# EAGLE design Part_Ninja_V1d (EAGLE 5.07)
PROJECT: Part Ninja v1d
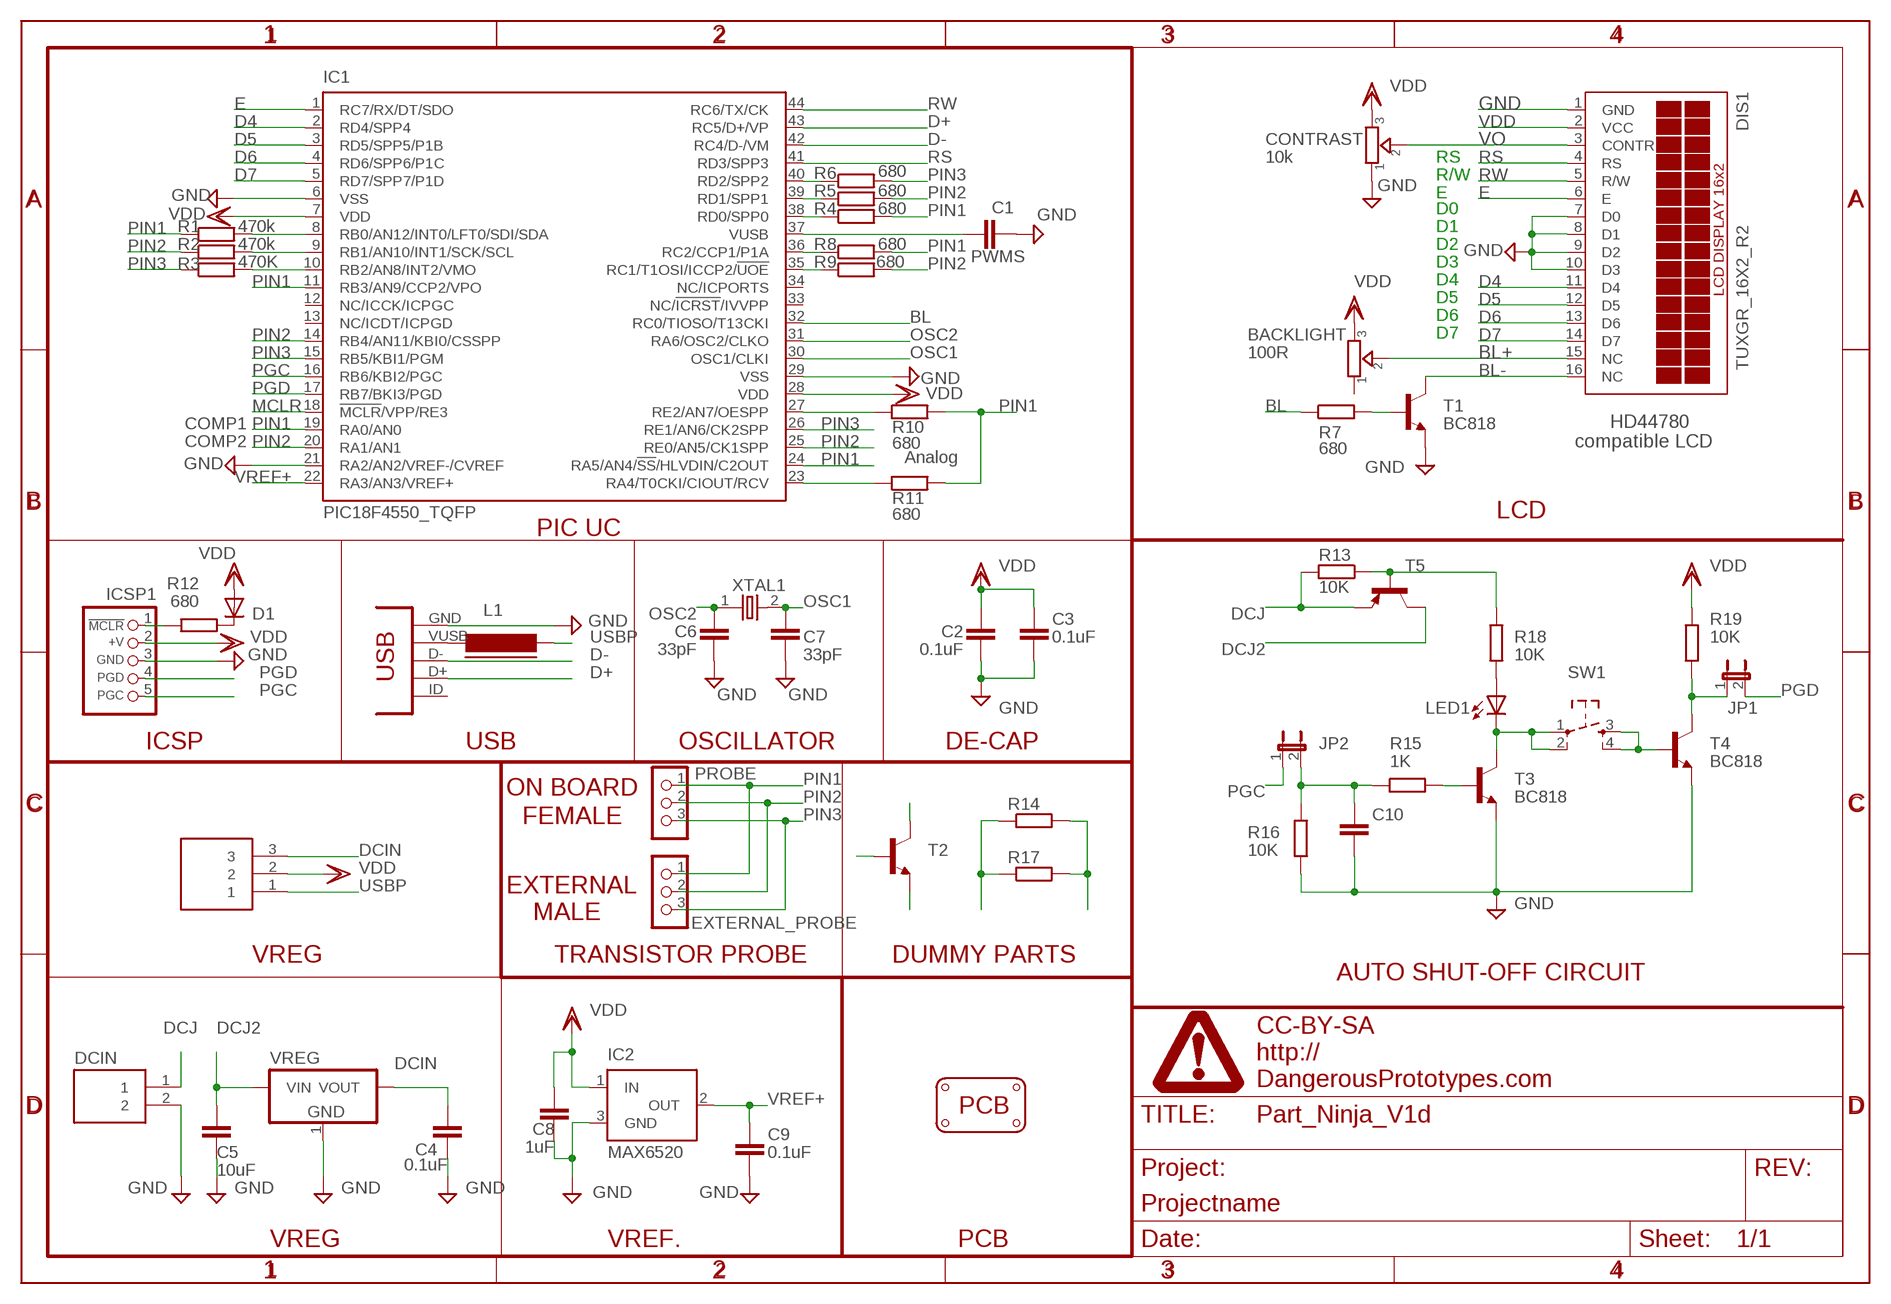
[diagram p0: schematic, sheet 1]

## Parts
BACKLIGHT  100R  TRIMMER-3306F  [TRIMMER_3306F]
C1  CAPC603  [C603]
C2  0.1uF  CAPC603  [C603]
C3  0.1uF  CAPC603  [C603]
C4  0.1uF  CAPC603  [C603]
C5  10uF  CAPC603  [C603]
C6  33pF  CAPC603  [C603]
C7  33pF  CAPC603  [C603]
C8  1uF  CAPC603  [C603]
C9  0.1uF  CAPC603  [C603]
C10  CAPC603  [C603]
CONTRAST  10k  TRIMMER-3306F  [TRIMMER_3306F]
D1  D-SOD123  [SOD123]
DCIN  HEADER1X2PTH  [M1X2]
DIS1  TUXGR_16X2_R2  [TUXGR_16X2_R2]
EXTERNAL_PROBE  CON_HEADER_1X03-2  [M1X3_2]
IC1  PIC18F4550_TQFP  [TQFP44]
IC2  MAX6520  [SOT23]
ICSP1  HEADER_PRG_PIC_ICSPB  [HEADER_PRG_1X05_ICSP_B]
JP1  JP1E  [JP1]
JP2  JP1E  [JP1]
L1  FERRITE_BEAD603  [FB603]
LED1  LED805  [LED-805]
PCB2  PCB_DP_RECTANGLE-6.2X10  [DP10062_V1]
PROBE  CON_HEADER_1X03-2  [M1X3_2]
PWR  HEADER1X3PTH  [M1X3]
R1  470k  RESISTORR603  [R603]
R2  470k  RESISTORR603  [R603]
R3  470K  RESISTORR603  [R603]
R4  680  RESISTORR603  [R603]
R5  680  RESISTORR603  [R603]
R6  680  RESISTORR603  [R603]
R7  680  RESISTORR603  [R603]
R8  680  RESISTORR603  [R603]
R9  680  RESISTORR603  [R603]
R10  680  RESISTORR603  [R603]
R11  680  RESISTORR603  [R603]
R12  680  RESISTORR603  [R603]
R13  10K  RESISTORR603  [R603]
R14  RESISTORR1206  [R1206]
R15  1K  RESISTORR603  [R603]
R16  10K  RESISTORR603  [R603]
R17  RESISTORR603  [R603]
R18  10K  RESISTORR603  [R603]
R19  10K  RESISTORR603  [R603]
SW1  SW_TACT  [SW_TACT_SMALL]
T1  BC818  NPNSOT23BEC  [SOT23-BEC]
T2  BC818  NPNSOT23BEC  [SOT23-BEC]
T3  BC818  NPNSOT23BEC  [SOT23-BEC]
T4  BC818  NPNSOT23BEC  [SOT23-BEC]
T5  BJT-PNPSOT23BEC  [SOT23-BEC]
U$1  DINA4_L  [DP_LOGO]
USB1  CON-USB-MINI-BUSB1  [CONN_USB_MINI-B]
VREG  LD1117-3.3SOT223  [SOT223]
XTAL1  OSC-XTAL  [HC-49U]

## Nets
BL: IC1.32(RC0/TIOSO/T13CKI) R7.1
BL+: BACKLIGHT.2 DIS1.15(NC)
BL-: DIS1.16(NC) T1.C
D4: DIS1.11(D4) IC1.2(RD4/SPP4)
D5: DIS1.12(D5) IC1.3(RD5/SPP5/P1B)
D6: DIS1.13(D6) IC1.4(RD6/SPP6/P1C)
D7: DIS1.14(D7) IC1.5(RD7/SPP7/P1D)
D+: IC1.43(RC5/D+/VP) USB1.D+
D-: IC1.42(RC4/D-/VM) USB1.D-
DCIN: C4.2 PWR.3 VREG.2(VOUT)
DCJ: DCIN.1 R13.2 T5.E
DCJ2: C5.2 T5.C VREG.3(VIN)
E: DIS1.6(E) IC1.1(RC7/RX/DT/SDO)
GND: C1.2 C2.1 C3.1 C4.1 C5.1 C6.1 C7.1 C8.1 C9.1 C10.1 CONTRAST.1 DCIN.2 DIS1.1(GND) DIS1.7(D0) DIS1.8(D1) DIS1.9(D2) DIS1.10(D3) IC1.6(VSS) IC1.21(RA2/AN2/VREF-/CVREF) IC1.29(VSS) IC2.3(GND) ICSP1.3(GND) R16.1 T1.E T3.E T4.E USB1.GND VREG.1(GND)
MCLR: IC1.18(!MCLR!/VPP/RE3) ICSP1.1(/MCLR) R12.1
N$1: R7.2 T1.B
N$2: IC1.8(RB0/AN12/INT0/LFT0/SDI/SDA) R1.2
N$3: IC1.9(RB1/AN10/INT1/SCK/SCL) R2.2
N$4: IC1.10(RB2/AN8/INT2/VMO) R3.2
N$5: IC1.38(RD0/SPP0) R4.1
N$6: IC1.39(RD1/SPP1) R5.1
N$7: IC1.40(RD2/SPP2) R6.1
N$8: IC1.27(RE2/AN7/OESPP) R10.1
N$9: LED1.A R18.1
N$10: C1.1 IC1.37(VUSB)
N$11: IC1.23(RA4/T0CKI/CIOUT/RCV) R11.1
N$12: IC1.36(RC2/CCP1/P1A) R8.1
N$13: IC1.35(RC1/T1OSI/ICCP2/!UOE) R9.1
N$14: D1.1(C) R12.2
N$16: SW1.3 SW1.4 T4.B
N$17: R13.1 R18.2 T5.B
N$18: LED1.C SW1.1 SW1.2 T3.C
N$19: R15.2 T3.B
N$21: JP1.1 R19.1 T4.C
N$22: C10.2 JP2.2 R15.1 R16.2
N$23: L1.1 USB1.VUSB
OSC1: C7.2 IC1.30(OSC1/CLKI) XTAL1.2
OSC2: C6.2 IC1.31(RA6/OSC2/CLKO) XTAL1.1
PGC: IC1.16(RB6/KBI2/PGC) ICSP1.5(PGC) JP2.1
PGD: IC1.17(RB7/BKI3/PGD) ICSP1.4(PGD) JP1.2
PIN1: EXTERNAL_PROBE.1 IC1.11(RB3/AN9/CCP2/VPO) IC1.19(RA0/AN0) IC1.24(RA5/AN4/!SS!/HLVDIN/C2OUT) PROBE.1 R1.1 R4.2 R8.2 R10.2 R11.2 R14.1 R17.1 T2.C
PIN2: EXTERNAL_PROBE.2 IC1.14(RB4/AN11/KBI0/CSSPP) IC1.20(RA1/AN1) IC1.25(RE0/AN5/CK1SPP) PROBE.2 R2.1 R5.2 R9.2 R14.2 R17.2 T2.B
PIN3: EXTERNAL_PROBE.3 IC1.15(RB5/KBI1/PGM) IC1.26(RE1/AN6/CK2SPP) PROBE.3 R3.1 R6.2 T2.E
RS: DIS1.4(RS) IC1.41(RD3/SPP3)
RW: DIS1.5(R/W) IC1.44(RC6/TX/CK)
USBP: L1.2 PWR.1
VDD: BACKLIGHT.3 C2.2 C3.2 C8.2 CONTRAST.3 D1.2(A) DIS1.2(VCC) IC1.7(VDD) IC1.28(VDD) IC2.1(IN) ICSP1.2(+V) PWR.2 R19.2
VO: CONTRAST.2 DIS1.3(CONTR)
VREF+: C9.2 IC1.22(RA3/AN3/VREF+) IC2.2(OUT)
Unconnected: BACKLIGHT.1 IC1.12(NC/ICCK/ICPGC) IC1.13(NC/ICDT/ICPGD) IC1.33(NC/!ICRST!/IVVPP) IC1.34(NC/ICPORTS) USB1.BODY@1(BODY) USB1.BODY@2(BODY) USB1.BODY@3(BODY) USB1.BODY@4(BODY) USB1.ID(USBID)

## Notes on the sheet
- RS
- R/W
- E
- D0
- D1
- PWMS | D2
- D3
- D4
- D5
- D6
- D7
- COMP1 | HD44780
- COMP2 | compatible LCD
- Analog
- LCD
- PIC UC
- ICSP | USB | OSCILLATOR | DE-CAP
- ON BOARD
- FEMALE
- EXTERNAL
- MALE
- VREG | TRANSISTOR PROBE | DUMMY PARTS
- AUTO SHUT-OFF CIRCUIT
- VREG | VREF. | PCB

## Library data of the parts
BACKLIGHT CONTRAST = dp_devices:TRIMMER: Trimmer resistor
C1-C10 = dp_devices:CAP
D1 = semicon-smd-ipc:D-: DIODE unfilled
DCIN = dp_devices:HEADER1X2
DIS1 = display-lcd:TUXGR_16X2_R2: Tuxgraphics LCD display 16x2 characters reflective, without background light Source: tuxgr_12x2_r2.pdf
EXTERNAL_PROBE PROBE = centered_logo:CON_HEADER_1X03
IC1 = microchip:PIC18F4*_TQFP: USB Microcontrollers with nanoWatt Technology High-Performance, Enhanced Flash, 28/40/44-Pin, Source: http://ww1.microchip.com/downloads/en/devicedoc/39632c.pdf; MF: MICROCHIP; MPN: PIC18F4550-I/PT; OC_FARNELL: 9321365; OC_NEWARK: 08J9633
IC2 = maxim:MAX6520: 1.2V Voltage Reference 50ppm/°C, SOT23, 3-Terminal Source: http://datasheets.maxim-ic.com/en/ds/MAX6520.pdf; MF: MAXIM; MPN: MAX6520EUR-T; OC_FARNELL: unknown; OC_NEWARK: 02J4586
ICSP1 = dp_devices:HEADER_PRG_PIC_ICSP: 5-pin PIC In Circuit Serial Programming header
JP1 JP2 = jumper:JP1E: JUMPER
L1 = dp_devices:FERRITE_BEAD
LED1 = DP2:LED
PCB2 = dp_devices:PCB_DP_RECTANGLE: Dangerous Prototypes Standard Rectangular PCB sizes
PWR = dp_devices:HEADER1X3
R1-R13 R15 R16 R18 R19 = dp_devices:RESISTOR
R14 R17 = fifo:RESISTOR
SW1 = dp_devices:SW_TACT
T1-T4 = dp_devices:NPN: Most commonly used is SOT23-BEC
T5 = DP2:BJT-PNP: Most commonly used is SOT23-BEC
U$1 = DP2:DINA4_L: A4 DP frame Standard Dangerous Prototypes schematic frame. Automagically adds the DP logo and standard texts to the PCB Use the atrribute in the schematic editor to change the fields.; FF1: fulfillment by; FF2: Seeed Studio; FF3: www.seeedstudio.com; LICENSE: CC-BY-SA; PROJECT: Projectname; URL1: http://; URL2: DangerousPrototypes.com
USB1 = dp_devices:CON-USB-MINI-B: USB connector
VREG = dp_devices:LD1117-3.3
XTAL1 = dp_devices:OSC-XTAL

## Board
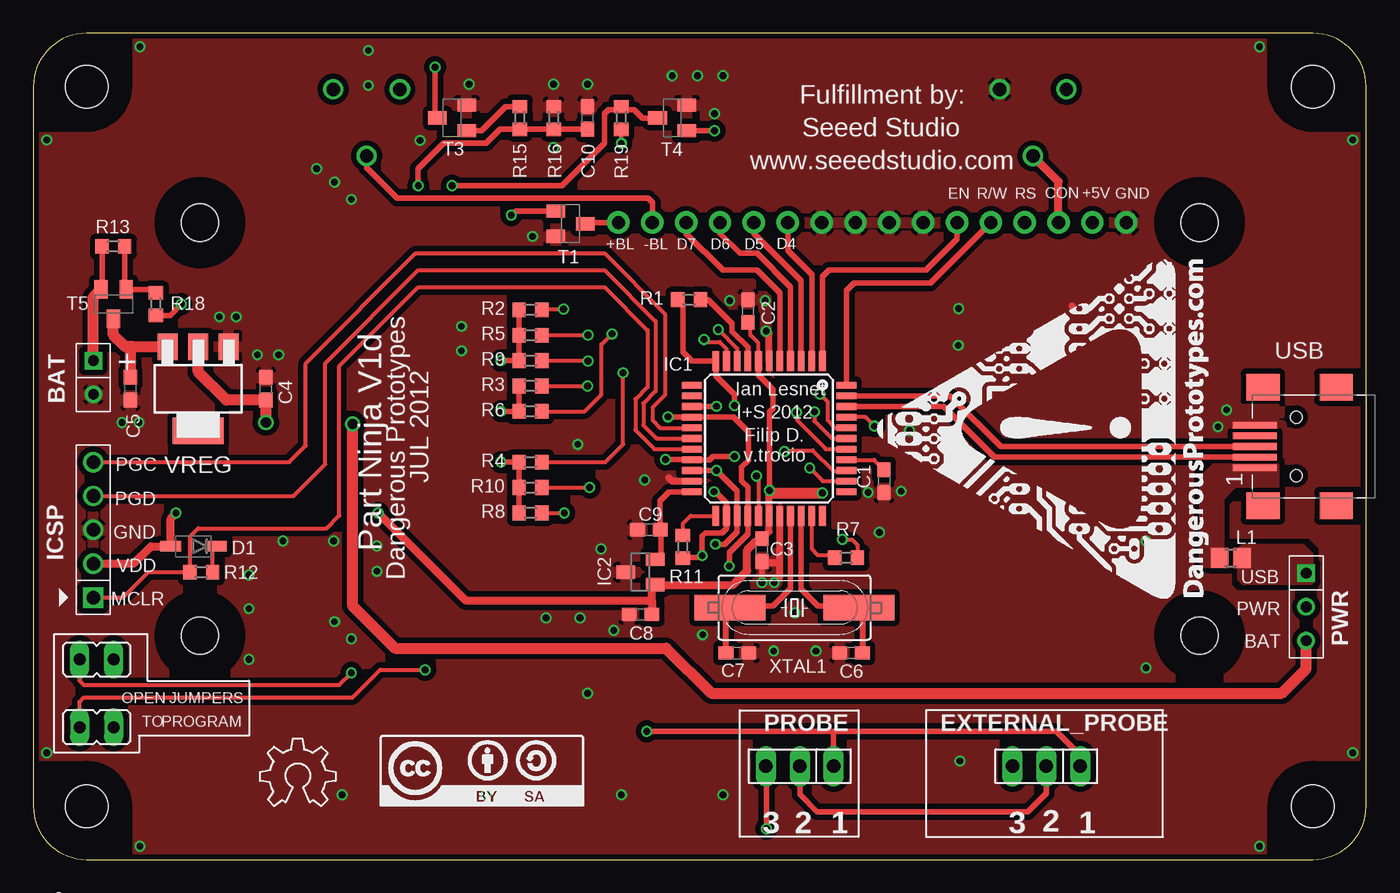
[diagram p1: board, top side]
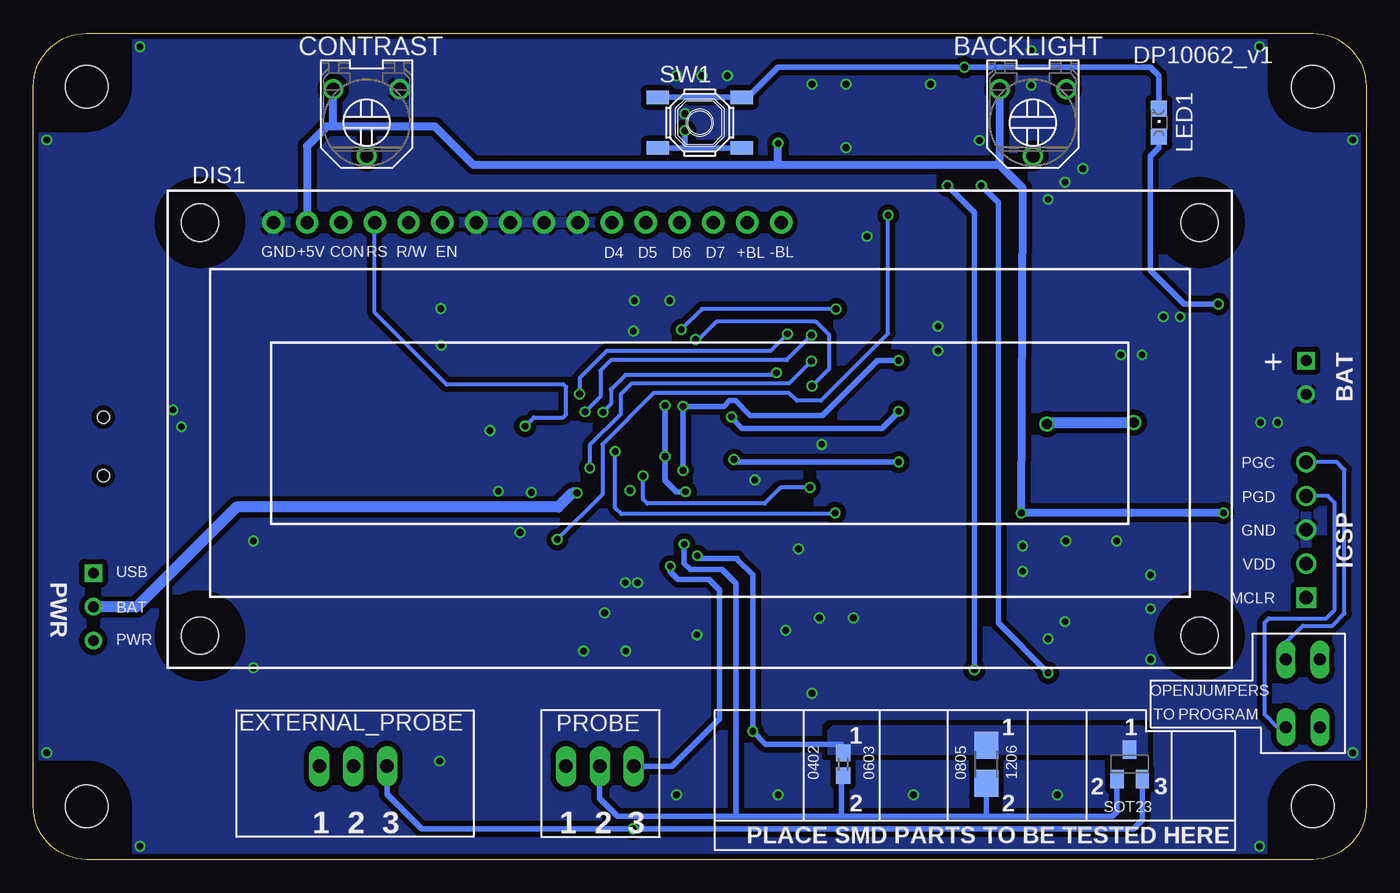
[diagram p2: board, bottom side, seen from below]

Size 100 x 62 mm. Coordinates in mm from the lower left corner, seen from the top.
Copper layers (1*16): Top 0.035mm / dielectric 1.5mm / Bottom 0.035mm
Design rules "Fusion_eagle_rule_v1.1": minimum track width 6mil, minimum drill 12mil, track to track 6mil, track to pad 6mil, pad to pad 6mil, via to via 6mil, smd to smd 0mil, copper to edge 10mil, drill to drill 10mil, minimum pad ring 10mil, minimum via ring 6mil, stop-mask expansion 2mil, vias tented up to drill 100mil, thermal gap 10mil
tRestrict: area 84.5,13.8 to 90.5,19.8; area 84.5,44.8 to 90.5,50.8; area 9.5,13.8 to 15.5,19.8; area 9.5,44.8 to 15.5,50.8
bRestrict: area 84.5,13.8 to 90.5,19.8; area 84.5,44.8 to 90.5,50.8; area 9.5,13.8 to 15.5,19.8; area 9.5,44.8 to 15.5,50.8

### Footprints (pad centres in the part's own frame; a part is rotated, then mirrored left to right if it is on the bottom)
TRIMMER_3306F = drill 1 round: 1 -2.5,-2.5; 2 0,2.5; 3 2.5,-2.5
C603 = smd 1.1 x 1: 1 -0.85,0; 2 0.85,0
SOD123 = smd 1.6 x 0.8: 1 -1.7,0; 2 1.7,0
M1X2 = drill 0.8 square: 1 -1.27,0 | drill 0.8 round: 2 1.27,0
TUXGR_16X2_R2 = drill 1 pad 1.676 round: 1 -32,15.5; 2 -29.46,15.5; 3 -26.92,15.5; 4 -24.38,15.5; 5 -21.84,15.5; 6 -19.3,15.5; 7 -16.76,15.5; 8 -14.22,15.5; 9 -11.68,15.5; 10 -9.14,15.5; 11 -6.6,15.5; 12 -4.06,15.5; 13 -1.52,15.5; 14 1.02,15.5; 15 3.56,15.5; 16 6.1,15.5 | hole 2.8: -37.5,-15.5; 37.5,-15.5; -37.5,15.5; 37.5,15.5
M1X3_2 = drill 1.016 long: 1 -2.54,0; 2 0,0; 3 2.54,0
TQFP44 = smd 1.5 x 0.5: 1 -5.8,4; 2 -5.8,3.2; 3 -5.8,2.4; 4 -5.8,1.6; 5 -5.8,0.8; 6 -5.8,0; 7 -5.8,-0.8; 8 -5.8,-1.6; 9 -5.8,-2.4; 10 -5.8,-3.2; 11 -5.8,-4; 23 5.8,-4; 24 5.8,-3.2; 25 5.8,-2.4; 26 5.8,-1.6; 27 5.8,-0.8; 28 5.8,0; 29 5.8,0.8; 30 5.8,1.6; 31 5.8,2.4; 32 5.8,3.2; 33 5.8,4 | smd 0.5 x 1.5: 12 -4,-5.8; 13 -3.2,-5.8; 14 -2.4,-5.8; 15 -1.6,-5.8; 16 -0.8,-5.8; 17 0,-5.8; 18 0.8,-5.8; 19 1.6,-5.8; 20 2.4,-5.8; 21 3.2,-5.8; 22 4,-5.8; 34 4,5.8; 35 3.2,5.8; 36 2.4,5.8; 37 1.6,5.8; 38 0.8,5.8; 39 0,5.8; 40 -0.8,5.8; 41 -1.6,5.8; 42 -2.4,5.8; 43 -3.2,5.8; 44 -4,5.8
SOT23 = smd 1 x 1.4: 1 -0.95,-1.1; 2 0.95,-1.1; 3 0,1.1
HEADER_PRG_1X05_ICSP_B = drill 1.016 square: 1 -5.08,0 | drill 1.016 round: 2 -2.54,0; 3 0,0; 4 2.54,0; 5 5.08,0
JP1 = drill 0.914 long: 1 0,-1.27; 2 0,1.27
FB603 = smd 1.3 x 1.5: 1 -0.85,0; 2 0.85,0
LED-805 = smd 1.2 x 1.2: A 0,-1.05; C 0,1.05
DP10062_V1 = hole 3.2: 4,4; 96,4; 96,58; 4,58
M1X3 = drill 0.8 square: 1 0,0 | drill 0.8 round: 2 2.54,0; 3 5.08,0
R603 = smd 1 x 1.1: 1 -0.85,0; 2 0.85,0
R1206 = smd 2.032 x 1.803: 1 -1.422,0; 2 1.422,0
R603' = smd 1.27 x 1.1: 1 -0.85,0; 2 0.85,0
SW_TACT_SMALL = smd 1.7 x 1: 1 -3.15,1.9; 2 3.15,1.9; 3 -3.15,-1.9; 4 3.15,-1.9
SOT23-BEC@1 = smd 1 x 1.4: B -0.95,-1.1; C 0,1.1; E 0.95,-1.1
SOT23-BEC = smd 1 x 1.4: B -0.95,-1.1; C 0,1.1; E 0.95,-1.1
CONN_USB_MINI-B = smd 2 x 2.5: BODY@1 -4.45,2.5; BODY@2 4.45,2.5; BODY@3 4.45,-3; BODY@4 -4.45,-3 | smd 0.5 x 3.3: D+ 0,3.1; D- -0.8,3.1; GND 1.6,3.1; ID 0.8,3.1; VUSB -1.6,3.1 | hole 0.9: -2.2,0; 2.2,0
SOT223 = smd 1.5 x 2: 1 -2.3,-3.15; 2 0,-3.15; 3 2.3,-3.15 | smd 3.8 x 2: 4 0,3.15
HC-49U = smd 5.334 x 1.93: 1 -4.826,0; 2 4.826,0

### Placement (x,y rotation side)
BACKLIGHT  25,55.3 180 bottom
C1  63.82,28.4 270 top
C2  53.61,41.16 270 top
C3  54.66,23.22 90 top
C4  17.45,35.33 270 top
C5  7.29,35.33 90 top
C6  61.36,15.5 0 top
C7  52.82,15.5 180 top
C8  45.55,18.39 0 top
C9  46.19,24.74 0 top
C10  41.58,55.65 270 top
CONTRAST  75,55.3 180 bottom
D1  12.01,23.5 180 top
DCIN  4.5,36.17 270 top
DIS1  50,32.3 0 bottom
EXTERNAL_PROBE  76,7 180 top
IC1  55.2,31.6 270 top
IC2  45.55,21.57 90 top
ICSP1  4.5,24.74 90 top
JP1  4.75,9.93 270 top
JP2  4.75,15.01 90 top
L1  89.84,22.63 0 top
LED1  15.55,55.3 0 bottom
PCB2  100,62 180 top
PROBE  57.5,7 180 top
PWR  95.5,21.5 270 top
R1  49.2,42.01 0 top
R2  37.3,41.25 0 top
R3  37.3,35.54 0 top
R4  37.3,29.82 180 top
R5  37.3,39.35 180 top
R6  37.3,33.63 180 top
R7  60.98,22.65 0 top
R8  37.3,26.01 180 top
R9  37.3,37.44 180 top
R10  37.3,27.92 180 top
R11  48.73,23.47 270 top
R12  12.61,21.57 0 top
R13  6,46 180 top
R14  28.5,7.15 270 bottom
R15  36.5,55.65 90 top
R16  39.04,55.65 270 top
R17  [R603']  39.25,7.15 270 bottom
R18  9.2,41.68 90 top
R19  44.12,55.65 270 top
SW1  50,55.3 0 bottom
T1  BC818  [SOT23-BEC@1]  40.31,47.71 270 top
T2  17.75,7.15 0 bottom
T3  31.42,55.65 90 top
T4  47.93,55.65 90 top
T5  6.02,41.68 180 top
U$1  1.91,-5.08 0 top  (outside the outline)
U$2  [DP_LOGO_ART_1X1]  88.12,19.62 90 top
U$4  [CC-BY-SA]  26,4 0 top
U$6  [OSHW_6X200_NOTEXT]  17,4 0 top
USB1  94.75,31 90 top
VREG  12.37,35.33 180 top
XTAL1  57.11,18.9 180 top

### Tracks (layer width: path | path; a pad name or v marks a point on that pad's centre or on a via)
BL
  Top 0.305: IC1.32 58.4,23.32 58.88,22.84 59.94,22.84 R7.1
BL+
  Top 0.406: DIS1.15 46.44,49.3 46.12,49.62 27.29,49.62 25,51.91 BACKLIGHT.2
BL-
  Top 0.406: DIS1.16 41.64,47.8 T1.C
D4
  Top 0.406: IC1.2 58.4,43.91 56.6,45.71 DIS1.11
D5
  Top 0.406: IC1.3 57.6,43.44 54.06,46.98 DIS1.12
D6
  Top 0.406: IC1.4 56.8,42.97 54.28,45.49 53.01,45.49 51.52,46.98 DIS1.13
D7
  Top 0.406: IC1.5 56,42.5 54.28,44.22 51.74,44.22 48.98,46.98 DIS1.14
D+
  Top 0.406: USB1.D+ 72.58,31 68.78,34.8 IC1.43
D-
  Top 0.406: USB1.D- 72.11,30.2 68.31,34 IC1.42
DCIN  (via drill 0.76)
  Top 0.813: v23.96,32.68 23.96,19.03 27.14,15.85 47.49,15.85 50.87,12.47 93.65,12.47 95.5,14.32 PWR.3 | VREG.2 12.37,36.6 14.49,34.48 C4.2 v17.45,32.79
  Bottom 0.813: v17.45,32.79 23.96,32.79 v23.96,32.68
DCJ
  Top 0.406: T5.E 5,42.78 5,43 5.15,43 R13.2
  Top 0.813: DCIN.1 4.5,42.21 T5.E
DCJ2
  Top 0.813: 7.5,38.48 VREG.3 | 7.5,38.48 6.89,38.48 6,39.38 6,40.56 T5.C | C5.2 7.29,38.27 7.5,38.48
E
  Top 0.406: IC1.1 59.2,43.74 59.68,44.22 66.98,44.22 69.3,46.54 DIS1.6
GND  (via drill 0.51)
  Top 0.406: v54.66,20.77 54.66,21.41 54.66,22.3 C3.1
  Top 0.457: 77.9,41.51 77.9,41.54 77.97,41.54 77.99,41.52
  Top 0.508: IC1.6 55.2,39.44 v54.98,39.66 | IC1.29 56,21.19 v55.58,20.77 | IC1.21 47.92,28.4 47.68,28.65 | 54.66,22.3 56,22.3 56,22.27
  other vias: 32.12,40.01 52.25,41.95 54.92,41.95 88.89,32.47 45.87,28.49 57.14,18.5 58.73,15.64 55.55,15.64 65.12,27.63 62.64,27.54 65.74,32.2 41.01,18.14 40.85,31.16 42.6,23.31 38.47,18.14 6.66,32.79 7.92,32.79 37.45,46.76 32.69,58.19 39.04,58.19 51.74,58.83 23.86,16.55 25.77,21.63 25.77,23.53 23.86,49.54 22.59,50.84 13.96,40.73 16.82,37.87 32.12,38.17 21.26,51.84 16.18,18.82 16.18,15.01 18.72,23.9 16.18,21.36 22.59,17.85 22.53,23.9 47.93,58.83 49.84,58.83 51.1,55.97 39.04,53.43 41.58,58.19 63.49,24.54 83.49,23.9 83.49,14.38 41.58,12.47 69.39,38.58 69.43,41.35 18.4,37.87 15.23,40.73 89.52,33.74 51.74,4.85 44.12,4.85 33.96,4.85 23.16,4.85 69.52,7.39 43.55,17.18 50.22,16.87 29.01,53.97 25.14,58.09 25.14,60.72 8,61 1,54 1,8 8,1 92,1 99,8 99,54 92,61
  pour Top (isolate 0.406, rank 6): 100,62 100,0 0,0 0,62
  pour Bottom (isolate 0.406, rank 6): 100,62 100,0 0,0 0,62
  pour Top (no thermals): 93.33,32.47 89.2,32.47 88.89,32.79 88.89,33.42 89.52,34.06 93.33,34.06
MCLR
  Top 0.305: IC1.18 46.6,30.8 45.17,32.23 45.17,34.52 46.09,35.44 46.09,39.71 42.85,42.95 28.88,42.95 22.94,37.01 22.94,25.8 21.99,24.85 12.37,24.85 11.76,24.24 R12.1 8.64,21.57 6.74,19.66 ICSP1.1
N$1  (via drill 0.51)
  Top 0.305: R7.2 61.83,23.61 61.42,24.01 v60.7,24.01
  Top 0.406: T1.B 36.18,48.66 v35.87,48.35
  Bottom 0.305: v60.7,24.01 57.3,27.41 57.3,31.16 53.46,35 43.3,35 42.72,34.42 40.91,34.42 35.87,39.48 v35.87,48.35
N$2
  Top 0.406: IC1.8 53.6,38.44 52.41,39.63 52.41,40.23 50.63,42.01 R1.2
N$3  (via drill 0.51)
  Top 0.305: v39.77,41.31 38.21,41.31 R2.2 | IC1.9 52.8,38.35 v51.39,39.76
  Bottom 0.305: v51.39,39.76 49.84,41.31 v39.77,41.31
N$4  (via drill 0.51)
  Top 0.305: R3.2 v41.58,35.54 | IC1.10 52,38.32 51.49,38.84 50.5,38.84 v50.31,39.03
  Top 0.406: R3.2
  Bottom 0.305: v41.58,35.54 40.28,36.84 40.28,39.35 41.3,40.36 48.76,40.36 50.09,39.03 v50.31,39.03
N$5  (via drill 0.51)
  Top 0.305: v44.25,36.52 44.25,31.16 42.91,29.82 R4.1 | IC1.38 59.46,30.8 57.3,32.97 57.3,33.54 v57.27,33.57
  Bottom 0.305: v44.25,36.52 44.53,36.36 55.58,36.36 56.66,35.28 56.66,34.17 v57.27,33.57
N$6  (via drill 0.51)
  Top 0.305: R5.1 v41.61,39.35 | v41.61,39.35 | IC1.39 59.9,31.6 58.6,32.9 v58.6,33.6
  Bottom 0.305: v41.61,39.35 43.49,37.47 56.66,37.47 57.46,36.68 57.46,34.74 v58.6,33.6
N$7  (via drill 0.51)
  Top 0.305: IC1.40 60.16,32.39 59.58,32.97 59.58,34.36 v59.01,34.93 | v43.42,39.44 42.63,38.65 42.63,34.9 41.36,33.63 R6.1
  Top 0.406: IC1.40
  Bottom 0.305: v43.42,39.44 44.69,38.17 56.98,38.17 59.01,36.14 v59.01,34.93
N$8  (via drill 0.51)
  Top 0.305: R10.1 v41.74,27.92 | IC1.27 54.4,28.8 v54.25,28.77
  Bottom 0.305: v41.74,27.92 43.93,27.92 45.14,26.71 53.93,26.71 54.25,27.03 v54.25,28.77
N$9  (via drill 0.51)
  Top 0.406: R18.1 10.25,40.83 v11.1,41.68
  Bottom 0.406: v11.1,41.68 13.64,41.68 16.18,44.22 16.18,52.79 15.54,53.43 LED1.A
N$10
  Top 0.305: IC1.37 63.07,30 C1.1
N$11
  Top 0.305: IC1.23 49.31,25.8 48.73,25.22 R11.1
N$12  (via drill 0.51)
  Top 0.305: R8.1 v39.84,26.01 | 60.96,29.16 60.03,29.16 58.47,30.71 56.38,30.71 v56.34,30.61
  Top 0.406: 60.96,29.16 IC1.36
  Bottom 0.305: 56.31,30.58 v56.34,30.61 56.34,26.39 55.87,25.92 39.93,25.92 v39.84,26.01
N$13  (via drill 0.51)
  Top 0.305: IC1.35 59.23,28.39 v58.25,29.38 | R9.1 41.58,37.44 v41.61,37.41
  Top 0.406: IC1.35
  Bottom 0.305: v58.25,29.38 58.25,31.09 55.93,33.41 55.93,34.9 55.11,35.73 43.3,35.73 v41.61,37.41
N$14
  Top 0.305: R12.2 13.46,23.26 D1.1
N$16  (via drill 0.51)
  Top 0.406: T4.B 49.52,54.7 v51.1,54.7
  Bottom 0.406: 51.1,53.4 v51.1,54.7 | SW1.4 51.1,53.4 | 51.1,53.4 SW1.3
N$17
  Top 0.406: R18.2 8.95,42.78 T5.B 7,42.78 7,43 6.85,43 R13.1
N$18  (via drill 0.51)
  Top 0.406: T3.C 30.15,55.65 v30.15,59.46
  Bottom 0.406: LED1.C 15.55,58.83 16.18,59.46 v30.15,59.46 44.12,59.46 46.38,57.2 SW1.2 SW1.1
N$19
  Top 0.406: R15.2 35.45,56.5 33.65,54.7 T3.B
N$21  (via drill 0.51)
  Top 0.305: v29.39,14.23 26.02,14.23 23.94,12.15 3.8,12.15 3.48,11.84 JP1.1
  Top 0.406: T4.C 45.71,55.65 45.07,56.28 44.34,56.28 R19.1 44.12,56.28 43.17,56.28 42.85,55.97 42.85,53.74 39.67,50.57 v31.42,50.57
  Bottom 0.406: v29.39,14.23 29.39,48.54 v31.42,50.57
N$22  (via drill 0.51)
  Top 0.305: JP2.2 3.48,13.42 3.8,13.11 22.96,13.11 v23.86,14.01
  Top 0.406: C10.2 R16.2 R15.1 35.02,54.8 33.96,53.74 30.79,53.74 28.88,51.84 v28.88,50.57
  Bottom 0.406: v28.88,50.57 27.61,49.3 27.61,17.75 v23.86,14.01
N$23
  pour Top (no thermals): 93.33,29.61 93.33,28.03 90.16,28.03 89.2,27.07 89.2,22 87.94,22 87.62,22.31 87.62,28.66 88.57,29.61
OSC1
  Top 0.406: IC1.30 56.8,20.34 55.49,19.03 52.41,19.03 XTAL1.2
  Top 0.457: C7.2 51.97,18.59 XTAL1.2
OSC2
  Top 0.406: IC1.31 57.6,20.31 58.88,19.03 61.81,19.03 XTAL1.1
  Top 0.457: C6.2 62.21,18.62 XTAL1.1
PGC
  Top 0.305: IC1.16 47.04,32.4 46.47,32.97 46.47,33.92 47.39,34.84 47.39,40.95 42.85,45.49 28.69,45.49 20.44,37.23 20.44,31.06 19.2,29.82 ICSP1.5
  Bottom 0.305: ICSP1.5 2.21,29.82 1.64,29.25 1.64,18.45 2.55,17.55 4.75,17.55 6.02,16.28 JP2.1
PGD
  Top 0.305: IC1.17 46.76,31.6 45.77,32.58 45.77,34.23 46.69,35.16 46.69,40.38 42.85,44.22 28.88,44.22 21.89,37.23 21.89,29.66 19.52,27.28 ICSP1.4
  Bottom 0.305: ICSP1.4 2.88,27.28 2.37,26.77 2.37,18.74 3.01,18.11 7.29,18.11 7.61,17.79 7.61,10.88 6.66,9.93 JP1.2
PIN1  (via drill 0.51)
  Top 0.305: 47.45,30.01 47.45,29.98 | v50.19,22.8 50.06,22.68 | 48.73,41.64 R1.1
  Top 0.406: 36.45,29.61 R10.2 R8.2 | 36.45,29.61 R4.2 | 36.45,29.61 36.66,29.82 v35.07,29.82 | v47.42,30.01 47.45,30.01 49.39,30.01 IC1.19 49.42,29.98 50.73,29.98 50.98,30.23 v52.6,30.23 | v52.6,34.08 52.6,34.9 51.2,36.3 IC1.11 49.4,37.4 48.73,38.08 48.73,41.64 | 50.06,22.68 49.42,22.68 R11.2 | v50.19,22.8 50.19,24.27 50.44,24.52 51.68,24.52 52,24.84 IC1.24 52,26.77 51.17,27.6 v51.08,27.6 | EXTERNAL_PROBE.1 78.54,7.82 76.74,9.61 60,9.61 | v46.02,9.61 60,9.61 | PROBE.1 60.04,9.57 60,9.61
  Bottom 0.406: v35.07,29.82 47.23,29.82 v47.42,30.01 | v51.08,27.6 51.74,27.6 52.6,28.46 v52.6,30.23 v52.6,34.08 | v50.19,22.8 49.96,22.58 47.2,22.58 47.2,22.54 46.02,21.36 v46.02,9.61 | R17.1 39.36,8.11 39.36,8.66 45.07,8.66 v46.02,9.61 | v46.02,9.61 46.07,9.66
  pour Bottom (no thermals): 40.31,8.03 16.5,8.03 16.5,9.61 16.82,9.93 39.99,9.93 40.31,9.61
PIN2  (via drill 0.51)
  Top 0.406: IC1.20 49.41,29.19 v51.27,29.19 52.8,27.65 IC1.25 52.8,24.6 51.87,23.66 v51.17,23.66 | IC1.14 51.25,34 v51.27,34.01 | R2.1 R5.2 R9.2 v35.07,37.44 | PROBE.2 57.5,4.88 58.8,3.58 74.6,3.58 76,4.98 EXTERNAL_PROBE.2
  Bottom 0.406: v51.27,29.19 v51.27,34.01 48.19,34.01 47.77,34.42 47.33,34.42 46.22,33.31 40.79,33.31 36.66,37.44 v35.07,37.44 | v51.17,23.66 51.17,23.03 51.17,22.23 50.69,21.76 48.33,21.76 47.3,20.73 47.3,3.26 | 47.3,3.26 56.19,3.26 57.53,4.61 57.53,6.97 PROBE.2 | 39.36,3.26 47.3,3.26 | 39.36,6.12 39.36,6.19 R17.2 39.25,6.23 39.36,6.12 | 39.36,3.26 39.36,6.12 | T2.B 18.7,3.6 19.04,3.26 28.56,3.26 | 28.56,3.26 39.36,3.26 | R14.2 28.5,3.33 28.56,3.26
PIN3  (via drill 0.51)
  Top 0.406: R3.1 R6.2 v35.07,33.63 | v47.61,33.22 49.38,33.22 IC1.15 52.53,33.2 53.65,32.09 53.65,29.95 53.14,29.44 53.14,28.42 53.62,27.95 53.62,25.81 IC1.26 | IC1.26 53.58,25.82 | IC1.26 53.6,24.44 52.22,23.06 v52.22,22.01 | v52.22,22.01 | PROBE.3 55,7 v55,2.31
  Bottom 0.305: v47.61,33.22 47.61,33.16
  Bottom 0.406: v52.22,22.01 52.22,21.63 51.61,21.03 49.3,21.03 48.5,20.23 48.5,10.56 52.07,7 PROBE.3 55,7 | 47.61,33.16 46.82,32.36 36.34,32.36 v35.07,33.63 | T2.E 16.8,2.96 17.45,2.31 v55,2.31 70.87,2.31 73.46,4.9 EXTERNAL_PROBE.3
RS  (via drill 0.51)
  Top 0.305: IC1.41 62.43,33.2 v63.11,32.52
  Bottom 0.305: v63.11,32.52 | v63.11,32.52 62.44,33.19 60.25,33.19 60.03,33.41 60.03,35.47 60.19,35.63 68.98,35.63 74.38,41.03 DIS1.4
RW
  Top 0.406: DIS1.5 67.3,43.27 61.58,43.27 61,42.69 IC1.44
USBP
  pour Top (no thermals): 95.87,20.73 90.79,20.73 90.47,21.04 90.47,23.27 90.79,23.58 95.24,23.58 95.87,22.95
VDD  (via drill 0.51)
  Top 0.305: IC1.7 54.4,38.75 53.8,39.35 53.8,40.12 C2.2 | v44.12,53.74 R19.2
  Top 0.406: IC1.7 54.4,36.37 55.49,35.28 55.49,33.85 55.23,33.6 v55.23,27.69
  Top 0.508: C3.2 55.2,24.61 IC1.28 55.2,27.66 v55.23,27.69
  Top 0.61: ICSP1.2 7.53,22.2 8.83,23.5 D1.2 10.31,25.58 v10.71,26.01 | IC2.1 52.51,20.62 53.55,21.66 53.55,23.22 54.19,23.85 54.45,23.85 C3.2 | IC2.1 46.65,20.71 46.66,20.73 | IC2.1 46.4,20.37 46.4,19.45 | 46.4,19.45 C8.2 | 46.4,19.45 32.42,19.45 v25.86,26.01
  Top 0.813: v59.2,27.5 55.42,27.5 v55.23,27.69
  Bottom 0.61: v10.71,26.01 v25.86,26.01 25.77,49.33 25.77,50.38 27.5,52.11 | 44.12,52.11 66.98,52.11 69.87,55 77.38,55 | 27.5,52.11 44.12,52.11 | 44.12,52.11 v44.12,53.74 | DIS1.2 79.46,53.54 78,55 77.38,55 | CONTRAST.3 77.5,55.12 77.38,55 | 27.5,52.11 BACKLIGHT.3
  Bottom 0.813: v59.2,27.5 59.57,27.5 60.63,26.44 84.76,26.44 92.24,18.96 PWR.2
VO
  Top 0.61: DIS1.3 76.92,50.88 CONTRAST.2
VREF+
  Top 0.406: IC2.2 46.85,22.52 47.11,22.77 47.11,24.61 C9.2 47.03,26.93 47.71,27.6 IC1.22 | IC1.22

### Text on the board
tPlace: Fulfillment by: | Seeed Studio | www.seeedstudio.com | Ian Lesnet | I+S 2012 | Filip D. | v.trocio | JUL 2012 | Part Ninja V1d | Dangerous Prototypes
tNames: EN | R/W | RS | CON | +5V | GND | +BL | -BL | D7 | D6 | D5 | D4 | USB | BAT | + | PGC | PGD | GND | VDD | ICSP | USB | MCLR | PWR | BAT | OPEN | JUMPERS | TO | PROGRAM | PROBE | EXTERNAL_PROBE | 3 | 2 | 1 | 3 | 2 | 1
bNames: -BL | +BL | D7 | D6 | D5 | D4 | EN | R/W | RS | CON | +5V | GND | BAT | + | PGC | PGD | ICSP | GND | VDD | USB | PWR | MCLR | BAT | PWR | JUMPERS | OPEN | PROGRAM | TO | 1 | 1 | 1 | 1206 | 0805 | 0603 | 0402 | 3 | 2 | 2 | 2 | SOT23 | 3 | 2 | 1 | 3 | 2 | 1 | PLACE SMD PARTS TO BE TESTED HERE